# Altium schematic sheet Schematics.SchDoc
size A3; SheetNumber: 1; SheetTotal: 1
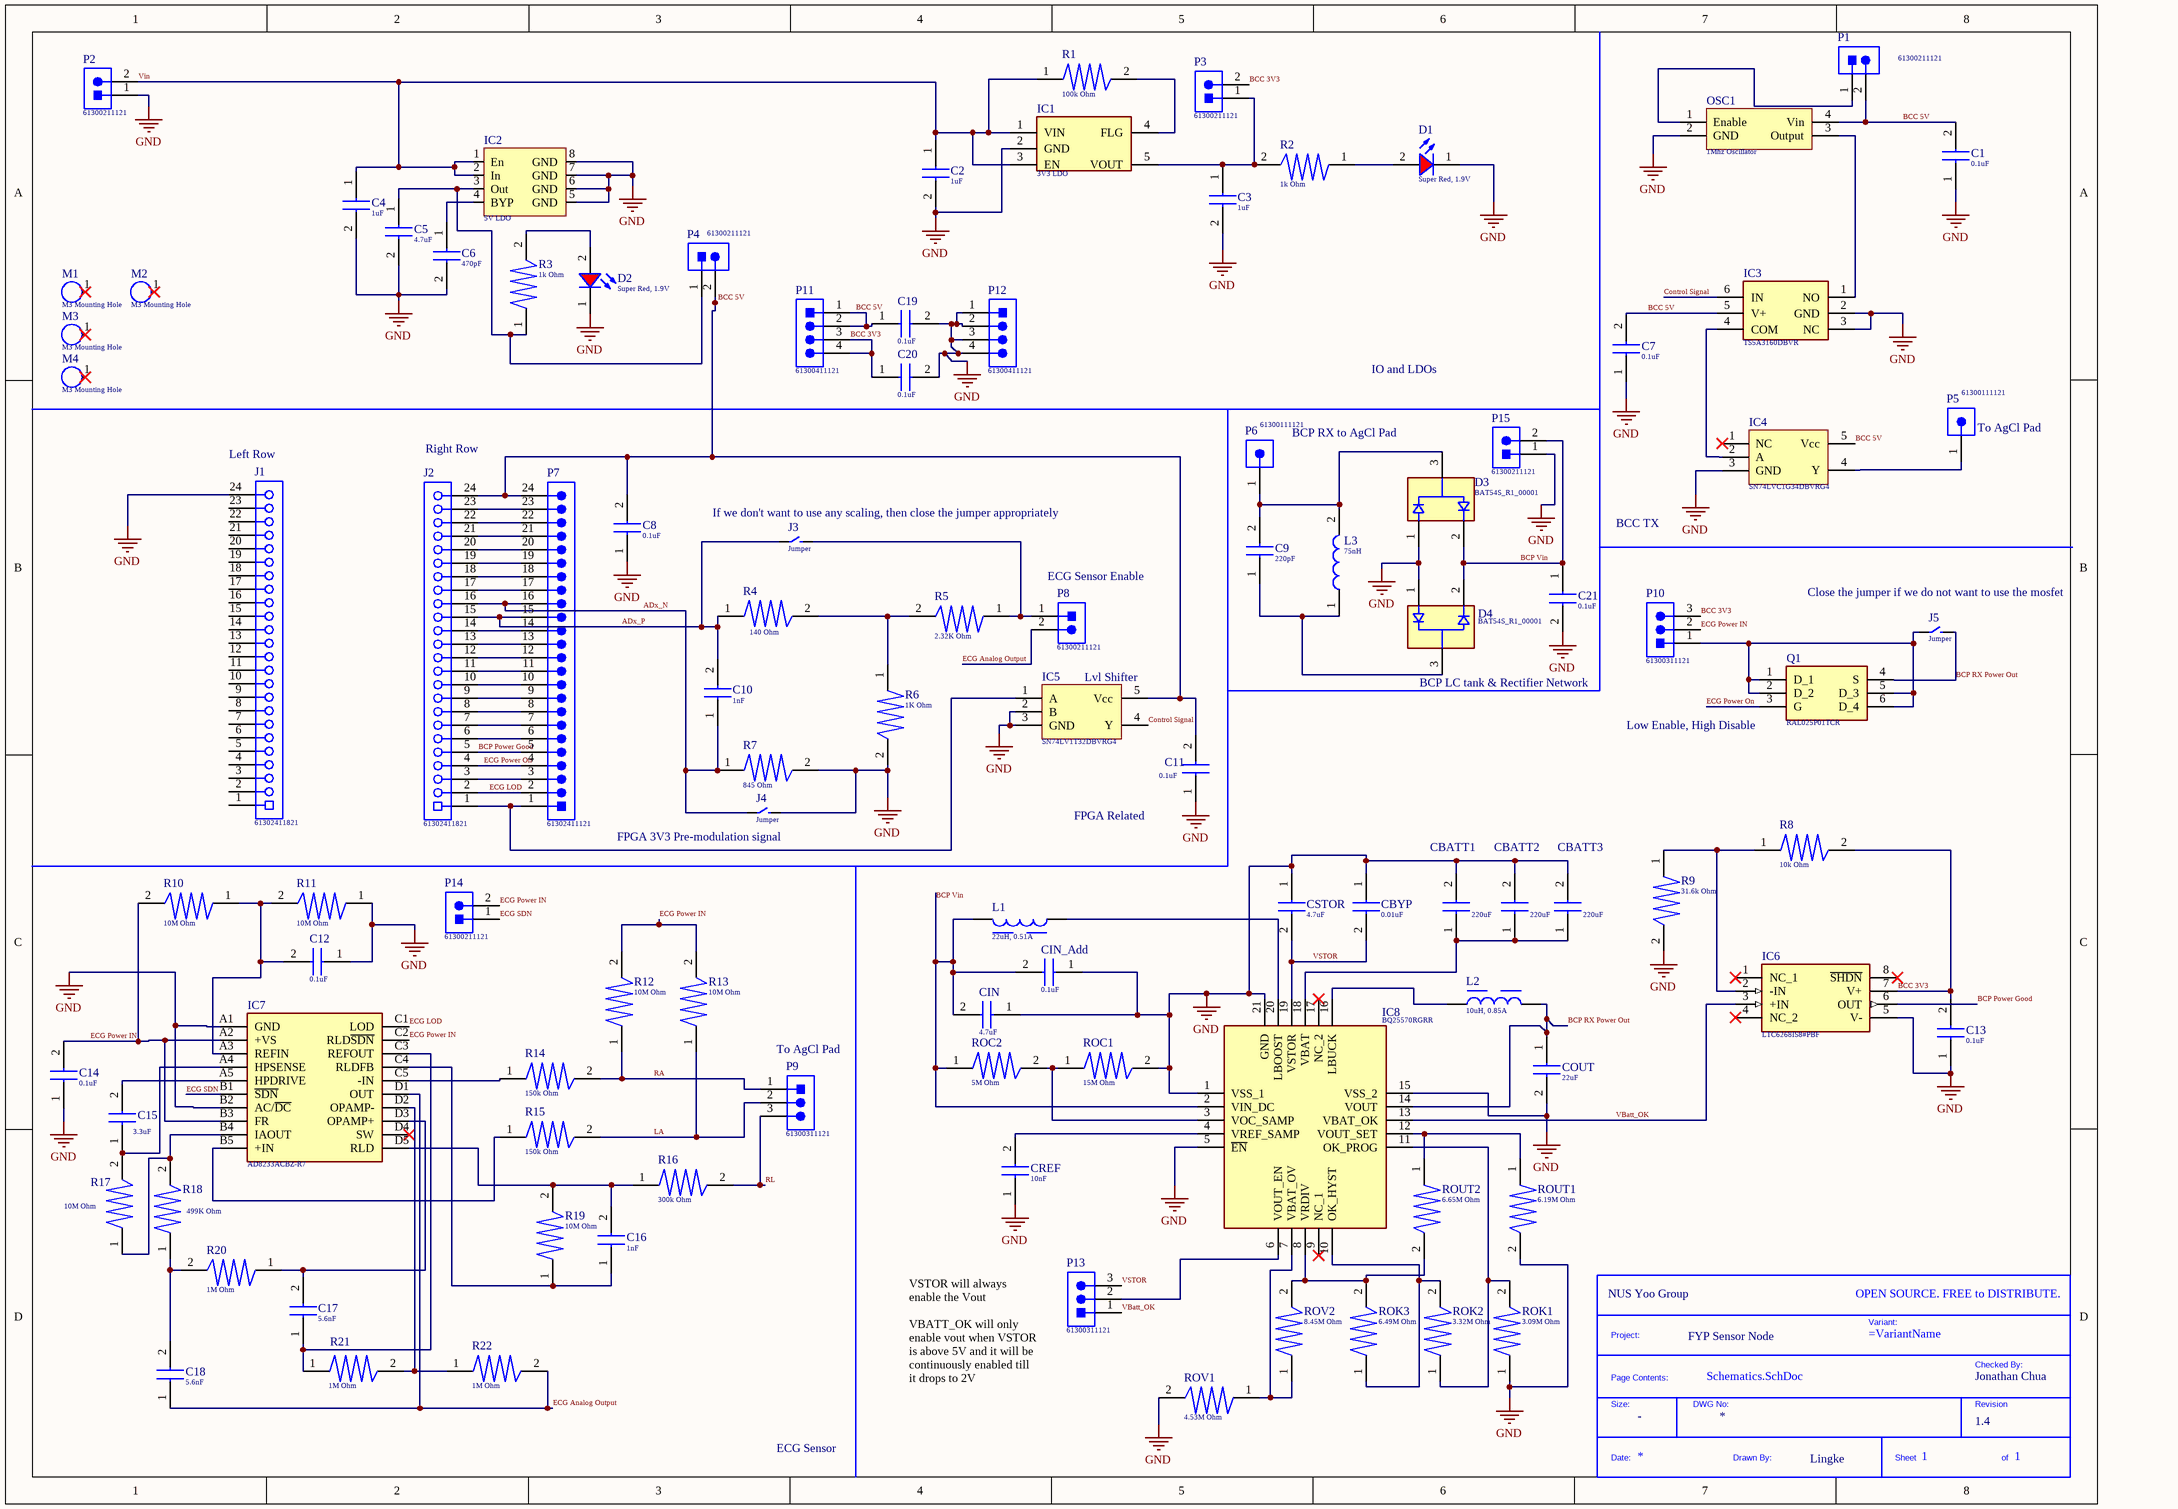
[diagram p0: Schematics.SchDoc]

## Parts
*  Project Name: FYP Sensor Node  Company: NUS Yoo Group  Drawn By: Lingke  Revision: 1.4  Checked By: Jonathan Chua  (hidden comment: Title_Block)  (no BOM)
C1  0.1uF  [0603]
C2  1uF  [0603]
C3  1uF  [0603]
C4  1uF  [0603]
C5  4.7uF  [0603]
C6  470pF  [0603]
C7  0.1uF  [0603]
C8  0.1uF  [0603]
C9  220pF  [0603]
C10  1nF  [0603]
C11  0.1uF  [0603]
C12  0.1uF  [0603]
C13  0.1uF  [0603]
C14  0.1uF  [0603]
C15  3.3uF  [0603]
C16  1nF  [0603]
C17  5.6nF  [0603]
C18  5.6nF  [0603]
C19  0.1uF  [0603]
C20  0.1uF  [0603]
C21  0.1uF  [0603]
CBATT1  220uF  [1206]
CBATT2  220uF  [1206]
CBATT3  220uF  [1206]
CBYP  0.01uF  [0603]
CIN  4.7uF  [0603]
CIN_Add  0.1uF  [0603]
COUT  22uF  [0603]
CREF  10nF  [0603]
CSTOR  4.7uF  [0603]
D1  Super Red, 1.9V  [WL-SMCW_0603_H=0.7mm]
D2  Super Red, 1.9V  [WL-SMCW_0603_H=0.7mm]
D3  BAT54S_R1_00001  [SOT95P240X110-3N]
D4  BAT54S_R1_00001  [SOT95P240X110-3N]
IC1  3V3 LDO  [SOT-23-5]
IC2  5V LDO  [MSOP-8_MS]
IC3  TS5A3160DBVR  [SOT-23-6]
IC4  SN74LVC1G34DBVRG4  [SOT-23-5]
IC5  SN74LV1T32DBVRG4  [SOT-23-5]
IC6  LTC6268IS8#PBF  [SOIC127P599X175-8N]
IC7  AD8233ACBZ-R7  [BGA20C40P5X4_204X170X56]
IC8  BQ25570RGRR  [QFN50P350X350X100-21N-D]
J1  61302411821  [61302411821]
J2  61302411821  [61302411821]
J3  Jumper  [0603]
J4  Jumper  [0603]
J5  Jumper  [0603]
L1  22uH, 0.51A  [WE-TPC_3816]
L2  10uH, 0.85A  [WE-MAPI_3015]
L3  75nH  [0603]
M1  M3 Mounting Hole  [M3 Hole]
M2  M3 Mounting Hole  [M3 Hole]
M3  M3 Mounting Hole  [M3 Hole]
M4  M3 Mounting Hole  [M3 Hole]
OSC1  1Mhz Oscillator  [CB3-3I-4M0000]
P1  61300211121  [61300211121]
P2  61300211121  [61300211121]
P3  61300211121  [61300211121]
P4  61300211121  [61300211121]
P5  61300111121  [61300111121]
P6  61300111121  [61300111121]
P7  61302411121  [61302411121]
P8  61300211121  [61300211121]
P9  61300311121  [61300311121]
P10  61300311121  [61300311121]
P11  61300411121  [61300411121]
P12  61300411121  [61300411121]
P13  61300311121  [61300311121]
P14  61300211121  [61300211121]
P15  61300211121  [61300211121]
Q1  RAL025P01TCR  [RAL025P01TCR]
R1  100k Ohm  [0603]
R2  1k Ohm  [0603]
R3  1k Ohm  [0603]
R4  140 Ohm  [0603]
R5  2.32K Ohm  [0603]
R6  1K Ohm  [0603]
R7  845 Ohm  [0603]
R8  10k Ohm  [0603]
R9  31.6k Ohm  [0603]
R10  10M Ohm  [0603]
R11  10M Ohm  [0603]
R12  10M Ohm  [0603]
R13  10M Ohm  [0603]
R14  150k Ohm  [0603]
R15  150k Ohm  [0603]
R16  300k Ohm  [0603]
R17  10M Ohm  [0603]
R18  499K Ohm  [0603]
R19  10M Ohm  [0603]
R20  1M Ohm  [0603]
R21  1M Ohm  [0603]
R22  1M Ohm  [0603]
ROC1  15M Ohm  [0603]
ROC2  5M Ohm  [0603]
ROK1  3.09M Ohm  [0603]
ROK2  3.32M Ohm  [0603]
ROK3  6.49M Ohm  [0603]
ROUT1  6.19M Ohm  [0603]
ROUT2  6.65M Ohm  [0603]
ROV1  4.53M Ohm  [0603]
ROV2  8.45M Ohm  [0603]

## Nets
GND: C1.1 C2.2 C3.2 C4.2 C5.2 C6.2 C7.1 C8.1 C11.1 C12.1 C13.1 C14.1 C19.2 C20.2 C21.2 CBATT1.2 CBATT2.2 CBATT3.2 CBYP.1 CIN.1 CIN_Add.1 COUT.2 CREF.1 CSTOR.1 D1.1(K) D2.1(K) D3.1(A) D4.1(A) IC1.2(GND) IC2.5(GND) IC2.6(GND) IC2.7(GND) IC2.8(GND) IC3.2(GND) IC3.3(NC) IC4.3(GND) IC5.2(B) IC5.3(GND) IC6.5(V-) IC7.A1(GND) IC7.B2(AC/~{DC}) IC8.1(VSS_1) IC8.5(~{EN}) IC8.15(VSS_2) IC8.21(GND) J1.24 J4.2 OSC1.2(GND) P2.1 P12.1 P12.2 P12.3 P12.4 P15.1 R6.2 R7.2 R9.2 R11.1 ROC1.2 ROK1.1 ROUT1.2 ROV1.2
ADx_N: C10.1 J2.16 J4.1 P7.16 R7.1
ADx_P: C10.2 J2.15 J3.1 P7.15 R4.1
BCC 3V3: C13.2 C20.1 IC6.7(V+) P3.2 P10.3 P11.3 P11.4 R8.2
BCC 5V: C1.2 C7.2 C8.2 C11.2 C19.1 IC3.5(V+) IC4.5(Vcc) IC5.5(Vcc) J2.24 OSC1.4(Vin) P1.2 P4.2 P7.24 P11.1 P11.2
BCP Power Good: IC6.6(OUT) J2.5 P7.5
BCP RX Power Out: COUT.1 IC8.14(VOUT) J5.2 L2.2 Q1.4(S)
BCP Vin: C21.1 CIN.2 CIN_Add.2 D3.2(K) D4.2(K) IC8.2(VIN_DC) L1.2 P15.2 ROC2.1
Control Signal: IC3.6(IN) IC5.4(Y)
ECG Analog Output: C18.1 IC7.D1(OUT) P8.2 R22.2
ECG LOD: IC7.C1(LOD) J2.2 P7.2
ECG Power IN: C14.2 IC7.A2(+VS) IC7.B3(FR) IC7.C2(RLD~{SDN}) P10.2 P14.2 R10.2 R12.2 R13.2
ECG Power On: J2.4 P7.4 Q1.3(G)
ECG SDN: IC7.B1(~{SDN}) P14.1
LA: P9.2 R13.1 R15.2
RA: P9.1 R12.1 R14.2
RL: P9.3 R16.2
VBatt_OK: IC6.3(+IN) IC8.13(VBAT_OK) P13.1
Vin: C2.1 C4.1 IC1.1(VIN) IC1.3(EN) IC2.1(En) IC2.2(In) P2.2 R1.1
VSTOR: CBYP.2 CSTOR.2 IC8.19(VSTOR) P13.3
NetC3_1: C3.1 IC1.5(VOUT) P3.1 R2.2
NetC5_1: C5.1 IC2.3(Out) P4.1 R3.1
NetC6_1: C6.1 IC2.4(BYP)
NetC9_1: C9.1 D4.3(A/K) L3.1
NetC9_2: C9.2 D3.3(A/K) L3.2 P6.1
NetC12_2: C12.2 IC7.A3(REFIN) R10.1 R11.2
NetC15_1: C15.1 IC7.A4(HPSENSE) R17.2
NetC15_2: C15.2 IC7.A5(HPDRIVE)
NetC16_1: C16.1 IC7.C4(RLDFB) R19.1
NetC16_2: C16.2 IC7.D5(RLD) R16.1 R19.2
NetC17_1: C17.1 IC7.C3(REFOUT) R21.1
NetC17_2: C17.2 IC7.D3(OPAMP+) R20.1
NetC18_2: C18.2 R18.1 R20.2
NetCBATT1_1: CBATT1.1 CBATT2.1 CBATT3.1 IC8.18(VBAT)
NetCREF_2: CREF.2 IC8.4(VREF_SAMP)
NetD1_2: D1.2(A) R2.1
NetD2_2: D2.2(A) R3.2
NetIC1_4: IC1.4(FLG) R1.2
NetIC3_1: IC3.1(NO) OSC1.3(Output)
NetIC3_4: IC3.4(COM) IC4.2(A)
NetIC4_4: IC4.4(Y) P5.1
NetIC5_1: IC5.1(A) J2.1 P7.1
NetIC6_2: IC6.2(-IN) R8.1 R9.1
NetIC7_B4: IC7.B4(IAOUT) R17.1 R18.2
NetIC7_B5: IC7.B5(+IN) R15.1
NetIC7_C5: IC7.C5(-IN) R14.1
NetIC7_D2: IC7.D2(OPAMP-) R21.2 R22.1
NetIC8_3: IC8.3(VOC_SAMP) ROC1.1 ROC2.2
NetIC8_6: IC8.6(VOUT_EN) P13.2
NetIC8_7: IC8.7(VBAT_OV) ROV1.1 ROV2.1
NetIC8_8: IC8.8(VRDIV) ROK3.2 ROUT2.2 ROV2.2
NetIC8_10: IC8.10(OK_HYST) ROK2.2 ROK3.1
NetIC8_11: IC8.11(OK_PROG) ROK1.2 ROK2.1
NetIC8_12: IC8.12(VOUT_SET) ROUT1.1 ROUT2.1
NetIC8_16: IC8.16(LBUCK) L2.1
NetIC8_20: IC8.20(LBOOST) L1.1
NetJ2_3: J2.3 P7.3
NetJ2_6: J2.6 P7.6
NetJ2_7: J2.7 P7.7
NetJ2_8: J2.8 P7.8
NetJ2_9: J2.9 P7.9
NetJ2_10: J2.10 P7.10
NetJ2_11: J2.11 P7.11
NetJ2_12: J2.12 P7.12
NetJ2_13: J2.13 P7.13
NetJ2_14: J2.14 P7.14
NetJ2_17: J2.17 P7.17
NetJ2_18: J2.18 P7.18
NetJ2_19: J2.19 P7.19
NetJ2_20: J2.20 P7.20
NetJ2_21: J2.21 P7.21
NetJ2_22: J2.22 P7.22
NetJ2_23: J2.23 P7.23
NetJ3_2: J3.2 P8.1 R5.1
NetJ5_1: J5.1 P10.1 Q1.1(D_1) Q1.2(D_2) Q1.5(D_3) Q1.6(D_4)
NetOSC1_1: OSC1.1(Enable) P1.1
NetR4_2: R4.2 R5.2 R6.1

Not connected (* = marked no-connect by the designer): IC4 1(NC)*; IC6 1(NC_1)* 4(NC_2)* 8(~{SHDN})*; IC7 D4(SW)*; IC8 9(NC_1)* 17(NC_2)*; J1 1 2 3 4 5 6 7 8 9 10 11 12 13 14 15 16 17 18 19 20 21 22 23; M1 1*; M2 1*; M3 1*; M4 1*

## Notes on the sheet
- IO and LDOs
- (near J2) Right Row
- BCP RX to AgCl Pad
- (near P5) To AgCl Pad
- (near J1) Left Row
- (near J3) If we don't want to use any scaling, then close the jumper appropriately
- (near P8) ECG Sensor Enable
- BCC TX
- (near J5) Close the jumper if we do not want to use the mosfet
- (near IC5) Lvl Shifter
- (near D4) BCP LC tank & Rectifier Network
- (near Q1) Low Enable, High Disable
- (near J4) FPGA 3V3 Pre-modulation signal
- FPGA Related
- (near P9) To AgCl Pad
- VSTOR will always enable the Vout
  VBATT_OK will only enable vout when VSTOR is above 5V and it will be continuously enabled till it drops to 2V
- ECG Sensor
- (in symbol Title_Block) OPEN SOURCE. FREE to DISTRIBUTE.; Variant:; Project:; Checked By:; Page Contents:; Size:; DWG No:; Revision; Date:; Drawn By:; Sheet; of

## Library data of the parts
* = Title_Block: Standard Title Block.; DWG No: *; Size: -
C1-C21 CBYP CIN CIN_Add COUT CREF CSTOR = Capacitor_0603: Capacitor
CBATT1-CBATT3 = Capacitor_1206: Capacitor
D1 D2 = 150060SS75000: WL-SMCW SMT Mono-color Chip LED Waterclear, size 0603, Super Red, 1.9V, 140deg; Chip Technology: AlInGaP; Dominant Wavelength typ.: 630nm; Luminous Intensity typ.: 60mcd; Peak Wavelength typ.: 645nm; Viewing Angle: 140deg; ComponentLink1Description: Manufacturer; ComponentLink1URL: http://www.we-online.de; ComponentLink2URL: https://www.we-online.com/catalog/datasheet/150060SS75000.pdf; ComponentLink2Description: Datasheet; Forward Voltage typ.: 1.9V; Emitting Color: Super Red; Mounting Technology: SMT; Operating Temperature: -40 to +85degC; Published Date: December 2019; Part Number: 150060SS75000; Packaging: Tape and Reel; Size: 0603; Publisher: Wurth Elektronik
D3 D4 = BAT54S_R1_00001: Schottky Diode; Manufacturer_Name: PANJIT; Datasheet Link: https://www.mouser.tw/datasheet/2/1057/BAT54_SERIES-1868754.pdf; Height: 1.1mm; Manufacturer_Part_Number: BAT54S_R1_00001
IC1 = MIC5216-3.3YM5-TR: Power Supply; Manufacturer_Name: Microchip; Manufacturer_Part_Number: MIC5317-3.3YM5-TR; Datasheet Link: https://componentsearchengine.com//MIC5317-3.3YM5-TR.pdf; Height: 1mm; Mouser2 Part Number: 998-MIC5317-3.3YM5TR; Mouser2 Price/Stock: https://www.mouser.com/Search/Refine.aspx?Keyword=998-MIC5317-3.3YM5TR
IC2 = MIC5219-5.0YMM-TR
IC3 = TS5A3160DBVR: Integrated Circuit; Manufacturer_Name: Texas Instruments; Datasheet Link: http://www.ti.com/lit/gpn/ts5a3160; Height: 1.45mm; Mouser2 Part Number: 595-TS5A3160DBVR; Mouser2 Price/Stock: https://www.mouser.com/Search/Refine.aspx?Keyword=595-TS5A3160DBVR; Manufacturer_Part_Number: TS5A3160DBVR
IC6 = LTC6268IS8#PBF: Integrated Circuit; Manufacturer_Name: Linear Technology; Datasheet Link: https://componentsearchengine.com//LTC6268IS8#PBF.pdf; Height: 1.752mm; Mouser2 Part Number: 584-LTC6268IS8#PBF; Mouser2 Price/Stock: https://www.mouser.com/Search/Refine.aspx?Keyword=584-LTC6268IS8%23PBF; Manufacturer_Part_Number: LTC6268IS8#PBF
IC7 = AD8233ACBZ-R7: Integrated Circuit; Manufacturer_Name: Analog Devices; Datasheet Link: https://componentsearchengine.com/Datasheets/2/AD8233ACBZ-R7.pdf; Height: 0.56mm; Manufacturer_Part_Number: AD8233ACBZ-R7
IC8 = BQ25570RGRR: Integrated Circuit; Manufacturer_Name: Texas Instruments; Datasheet Link: http://www.ti.com/lit/gpn/bq25570; Height: 1mm; Mouser2 Part Number: 595-BQ25570RGRR; Mouser2 Price/Stock: https://www.mouser.com/Search/Refine.aspx?Keyword=595-BQ25570RGRR; Manufacturer_Part_Number: BQ25570RGRR
J1 J2 = 61302411821: WR-PHD Socket Header, THT, pitch 2.54mm, Single Row, Vertical, 24p; Manufacturer: Wurth Elektronik; Pin Number: 24; Rated Current: 3A; Working Voltage: 250VAC; Withstanding Voltage: 500VAC; Contact Resistance: 20mOhm; ComponentLink1Description: Manufacturer; ComponentLink1URL: http://www.we-online.de; ComponentLink2Description: Datasheet; ComponentLink2URL: https://www.we-online.com/catalog/datasheet/61302411821.pdf; Manufacturer Part Number: 61302411821; Pitch: 2.54mm; Operating Temperature: -40 to +125degC; Mounting Technology: THT; Packaging: Tray; Gender: Socket Header; Row Number: Single; Orientation: Vertical
J3-J5 = 0603_Jumper: Capacitor
L1 = 744031220: WE-TPC SMT Tiny Power Inductor, size 3816, 22uH, 0.51A, 450mOhm; Manufacturer: Wurth Elektronik; DC Resistance typ.: 410mOhm; Saturation Current: 0.36A; Self Resonant Frequency: 26MHz; ComponentLink1Description: Manufacturer Link; ComponentLink1URL: http://www.we-online.de; ComponentLink2Description: Datasheet; ComponentLink2URL: https://www.we-online.com/catalog/datasheet/744031220.pdf; DC Resistance max.: 450mOhm; Height: 1.65mm; Inductance: 22uH; Length: 3.8mm; Manufacturer Part Number: 744031220; Mounting Technology: SMT; Operating Temperature max.: 125C; Operating Temperature min.: -40C; Packaging: Tape and Reel; Rated Current: 0.51A; Size: 3816; Width: 3.8mm
L2 = 74438335100: WE-MAPI SMT Power Inductor, size 3015, 10uH, 0.85A; Manufacturer: Wurth Elektronik; DC Resistance typ.: 446mOhm; DC Resistance max.: 513mOhm; Self Resonant Frequency: 21MHz; Saturation Current: 2A; ComponentLink1Description: Manufacturer; ComponentLink1URL: http://www.we-online.de; ComponentLink2Description: Datasheet; ComponentLink2URL: https://www.we-online.com/catalog/datasheet/74438335100.pdf; Mounting Technology: SMT; Operating Temperature: -40 to +125degC; Packaging: Tape and Reel; Size: 3015; Inductance: 10uH; Manufacturer Part Number: 74438335100; Rated Current: 0.85A; Height: 1.5mm; Length: 3mm; Width: 3mm
L3 = Inductor_0603: Inductor
M1-M4 = M3_Mounting_hole
OSC1 = LFSPXO053327Bulk
P1-P4 P8 P14 P15 = 61300211121: WR-PHD Pin Header, THT, pitch 2.54mm, Single Row, Vertical, 2p; Manufacturer: Wurth Elektronik; Pin Number: 2; Rated Current: 3A; Working Voltage: 250VAC; Withstanding Voltage: 500VAC; Contact Resistance: 20mOhm; ComponentLink1Description: Manufacturer; ComponentLink1URL: http://www.we-online.de; ComponentLink2Description: Datasheet; ComponentLink2URL: https://www.we-online.com/catalog/datasheet/61300211121.pdf; Manufacturer Part Number: 61300211121; Pitch: 2.54mm; Operating Temperature: -40 to +105degC; Mounting Technology: THT; Packaging: Bag; Gender: Pin Header; Row Number: Single; Orientation: Vertical
P5 P6 = 61300111121: WR-PHD Pin Header, THT, pitch 2.54mm, Single Row, Vertical, 1p; Manufacturer: Wurth Elektronik; Pin Number: 1; Rated Current: 3A; Working Voltage: 250VAC; Withstanding Voltage: 500VAC; Contact Resistance: 20mOhm; ComponentLink1Description: Manufacturer; ComponentLink1URL: http://www.we-online.de; ComponentLink2Description: Datasheet; ComponentLink2URL: https://www.we-online.com/catalog/datasheet/61300111121.pdf; Manufacturer Part Number: 61300111121; Pitch: 2.54mm; Operating Temperature: -40 to +105degC; Mounting Technology: THT; Packaging: Bag; Gender: Pin Header; Row Number: Single; Orientation: Vertical
P7 = 61302411121: WR-PHD Pin Header, THT, pitch 2.54mm, Single Row, Vertical, 24p; Manufacturer: Wurth Elektronik; Pin Number: 24; Rated Current: 3A; Working Voltage: 250VAC; Withstanding Voltage: 500VAC; Contact Resistance: 20mOhm; ComponentLink1Description: Manufacturer; ComponentLink1URL: http://www.we-online.de; ComponentLink2Description: Datasheet; ComponentLink2URL: https://www.we-online.com/catalog/datasheet/61302411121.pdf; Manufacturer Part Number: 61302411121; Pitch: 2.54mm; Operating Temperature: -40 to +105degC; Mounting Technology: THT; Packaging: Bag; Gender: Pin Header; Row Number: Single; Orientation: Vertical
P9 P10 P13 = 61300311121: WR-PHD Pin Header, THT, pitch 2.54mm, Single Row, Vertical, 3p; Manufacturer: Wurth Elektronik; Pin Number: 3; Rated Current: 3A; Working Voltage: 250VAC; Withstanding Voltage: 500VAC; Contact Resistance: 20mOhm; ComponentLink1Description: Manufacturer; ComponentLink1URL: http://www.we-online.de; ComponentLink2Description: Datasheet; ComponentLink2URL: https://www.we-online.com/catalog/datasheet/61300311121.pdf; Manufacturer Part Number: 61300311121; Pitch: 2.54mm; Operating Temperature: -40 to +105degC; Mounting Technology: THT; Packaging: Bag; Gender: Pin Header; Row Number: Single; Orientation: Vertical
P11 P12 = 61300411121: WR-PHD Pin Header, THT, pitch 2.54mm, Single Row, Vertical, 4p; Manufacturer: Wurth Elektronik; Pin Number: 4; Rated Current: 3A; Working Voltage: 250VAC; Withstanding Voltage: 500VAC; Contact Resistance: 20mOhm; ComponentLink1Description: Manufacturer; ComponentLink1URL: http://www.we-online.de; ComponentLink2Description: Datasheet; ComponentLink2URL: https://www.we-online.com/catalog/datasheet/61300411121.pdf; Manufacturer Part Number: 61300411121; Pitch: 2.54mm; Operating Temperature: -40 to +105degC; Mounting Technology: THT; Packaging: Bag; Gender: Pin Header; Row Number: Single; Orientation: Vertical
Q1 = RAL025P01TCR: MOSFET (P-Channel); Manufacturer_Name: ROHM Semiconductor; Datasheet Link: https://componentsearchengine.com/Datasheets/2/RAL025P01TCR.pdf; Height: 0.85mm; Manufacturer_Part_Number: RAL025P01TCR
R1-R22 ROC1 ROC2 ROK1-ROK3 ROUT1 ROUT2 ROV1 ROV2 = Resistor
IC4 = SN74LVC1G34DBVRG4: Supplier 1: Mouser; Supplier Part Number 1: 595-74LVC1G125DBVRG4
IC5 = SN74LV1T32DBVRG4: Supplier 1: Mouser; Supplier Part Number 1: 595-SN74LV1T32DBVRG4